# Altium schematic sheet In_put .SchDoc
size A4
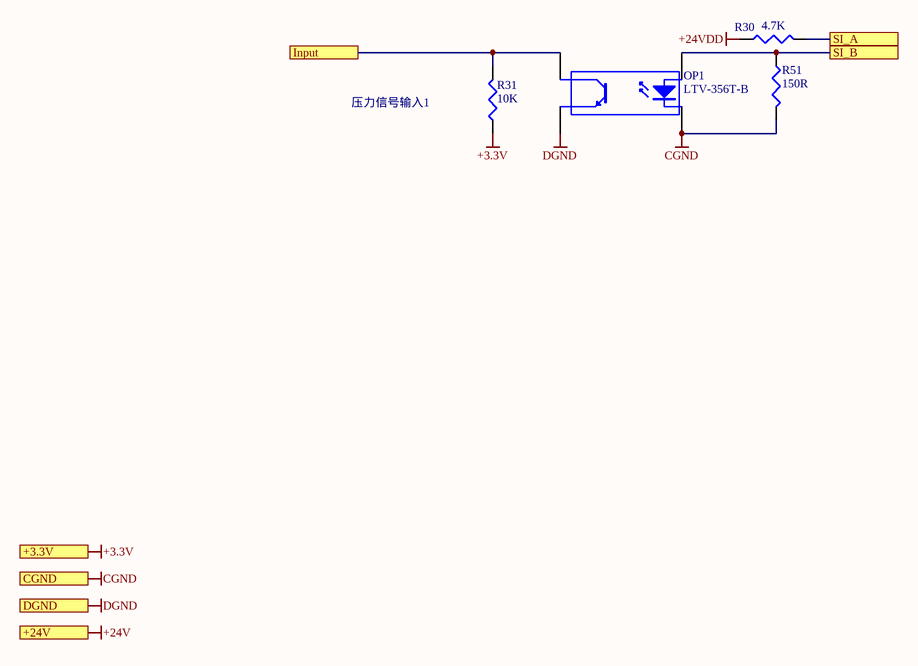
[diagram p0: In_put .SchDoc]

## Parts
OP1  LTV-356T-B  [TLV-356]
R30  4.7K  [0805R]
R31  10K  [0805R]
R51  150R  [0805R]

## Ports
+3.3V, +24V, CGND, DGND, Input, SI_A, SI_B

## Nets
+3.3V: R31.1 ; port +3.3V
+24V: port +24V
+24VDD: R30.1
CGND: OP1.2(K) R51.2 ; port CGND
DGND: OP1.3(E) ; port DGND
Input: OP1.4(C) R31.2 ; port Input
SI_A: R30.2 ; port SI_A
SI_B: OP1.1(A) R51.1 ; port SI_B

## Notes on the sheet
- 压力信号输入1

## Library data of the parts
OP1 = OPTOISO1: 品牌名称 / LITEON(光宝) / 商品型号 / LTV-356T-B / 商品编号 / C10804 / 商品封装 / SOP-4-2.54mm
R30 R51 = RES1: 电阻类型：厚膜电阻 阻值：4.7kΩ 精度：±1% 功率：125mW 温度系数：±100ppm/℃
R31 = RES1: 品牌： UNI-ROYAL(厚声) 型号： 0805W8F1002T5E 电阻类型：厚膜电阻 阻值：10kΩ 精度：±1% 功率：125mW 温度系数：±100ppm/℃